# EAGLE schematic ATmega328P_CustomBd_LCD_RTCDS1307_DHT11 (EAGLE 8.2.0)
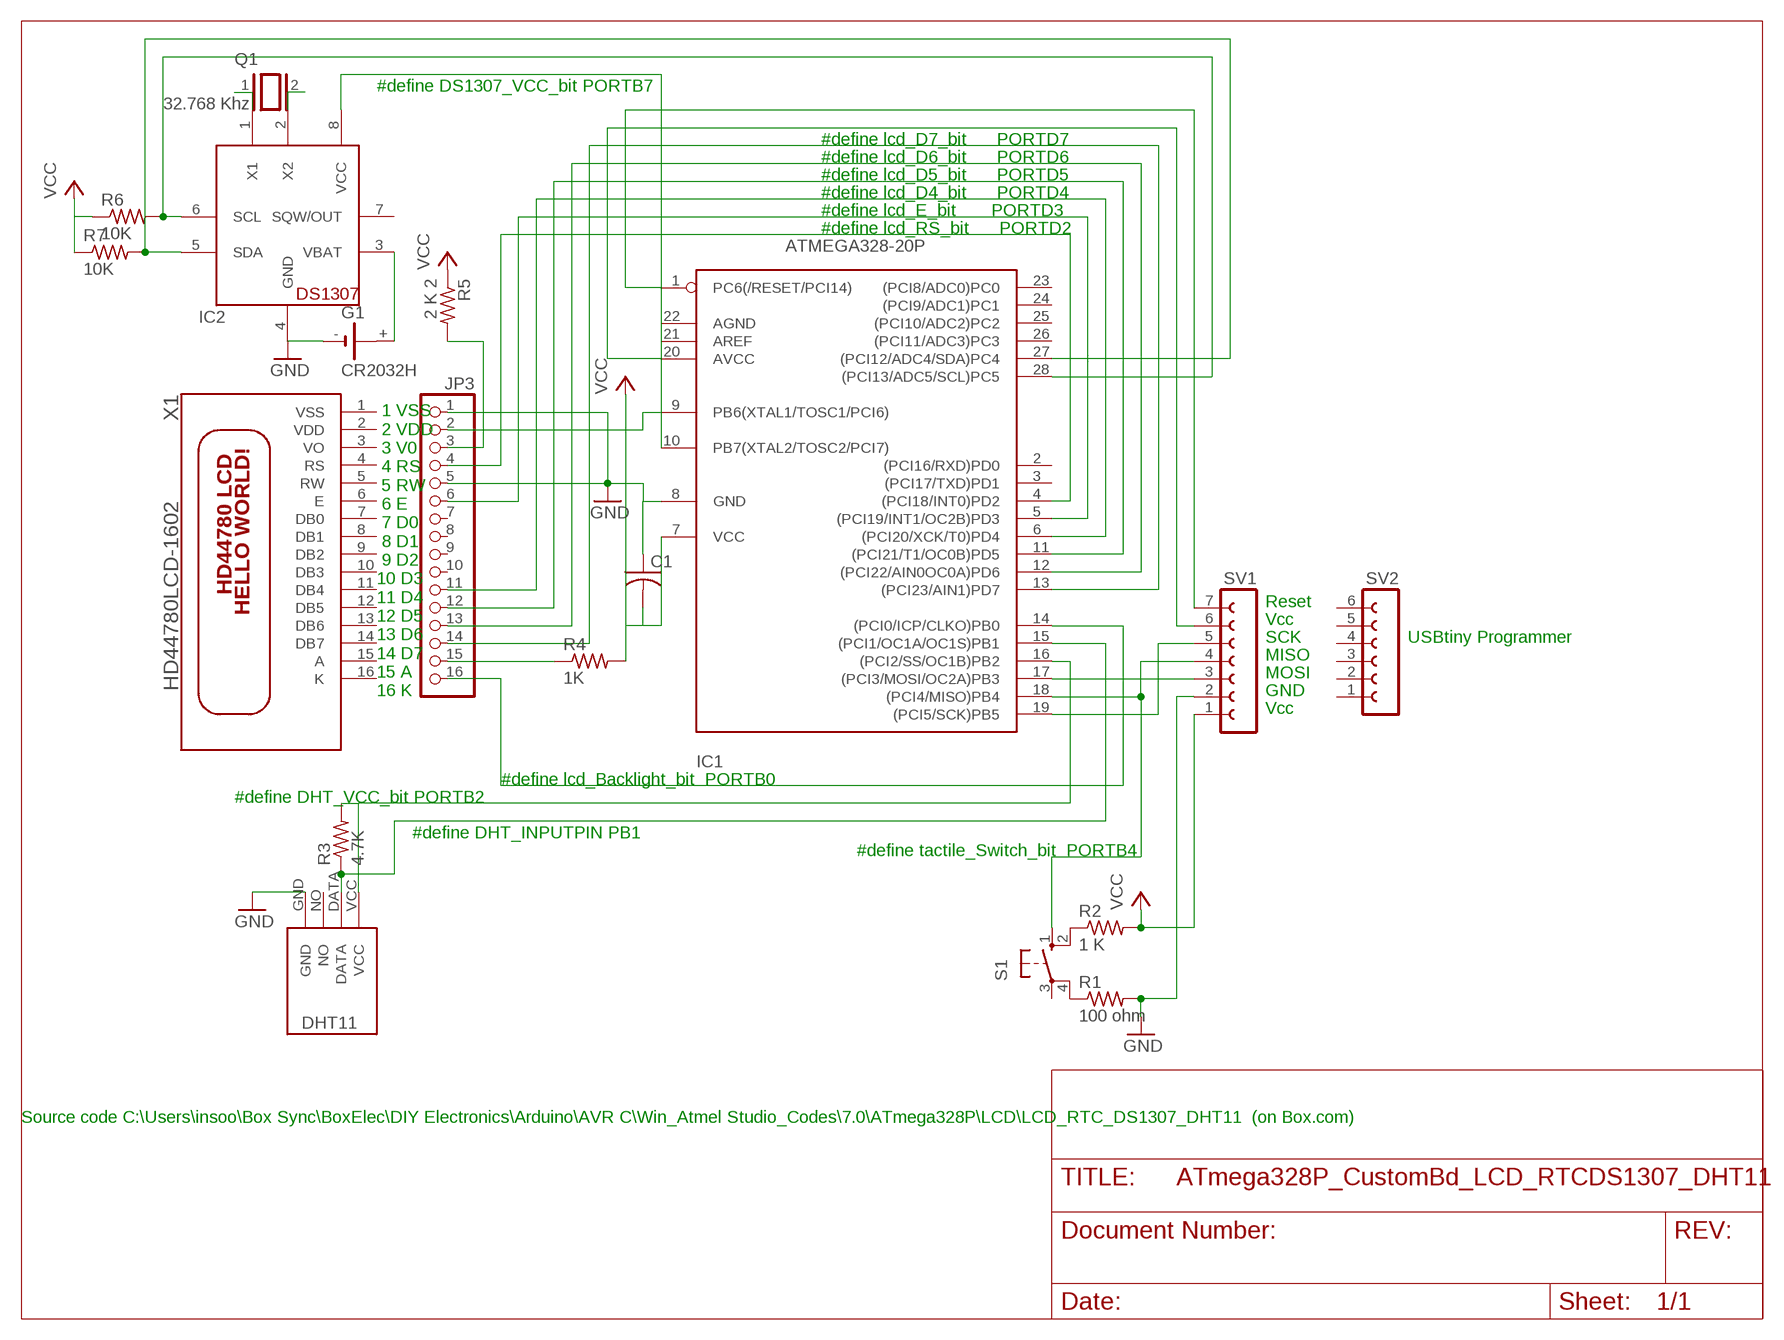
[diagram p0: schematic, sheet 1]

## Parts
C1  C-US025-024X044  [C025-024X044]
G1  CR2032H  [CR2032H]
IC1  ATMEGA328-20P  [DIL28-3]
IC2  DS1307  [DIL08]
JP3  PINHD-1X16  [1X16]
Q1  32.768 Khz  XTAL/S  [QS]
R1  100 ohm  R-US_0204/5  [0204/5]
R2  1 K  R-US_0204/5  [0204/5]
R3  4.7K  R-US_0204/5  [0204/5]
R4  1K  R-US_0204/5  [0204/5]
R5  2 K 2  R-US_0204/5  [0204/5]
R6  10K  R-US_0204/5  [0204/5]
R7  10K  R-US_0204/5  [0204/5]
S1  40-XX  [B3F-40XX]
SV1  FE07-1  [FE07]
SV2  FE06-1  [FE06]
U$1  DHT11  [DHT11]
X1  HD44780LCD-1602  [LCD1602]

## Nets
GND: C1.1 G1.- IC1.8(GND) IC2.4(GND) JP3.1 JP3.5 R1.2 SV1.2 U$1.GND
N$1: IC1.1(PC6(/RESET/PCI14)) SV1.7
N$2: IC1.20(AVCC) SV1.6
N$3: IC1.14((PCI0/ICP/CLKO)PB0) JP3.16
N$4: IC1.18((PCI4/MISO)PB4) S1.1(S) SV1.4
N$5: IC1.17((PCI3/MOSI/OC2A)PB3) SV1.3
N$6: R1.1 S1.4(P1)
N$7: R2.1 S1.2(S1)
N$8: IC1.19((PCI5/SCK)PB5) SV1.5
N$9: IC1.4((PCI18/INT0)PD2) JP3.4
N$10: C1.2 IC1.7(VCC) R4.2 ; supply symbol labelled VCC
N$11: IC1.11((PCI21/T1/OC0B)PD5) JP3.12
N$12: IC1.5((PCI19/INT1/OC2B)PD3) JP3.6
N$13: IC1.6((PCI20/XCK/T0)PD4) JP3.11
N$14: IC1.12((PCI22/AIN0OC0A)PD6) JP3.13
N$15: IC1.13((PCI23/AIN1)PD7) JP3.14
N$16: IC1.9(PB6(XTAL1/TOSC1/PCI6)) JP3.2
N$17: IC1.10(PB7(XTAL2/TOSC2/PCI7)) IC2.8(VCC)
N$18: IC1.15((PCI1/OC1A/OC1S)PB1) R3.1 U$1.DATA
N$19: JP3.3 R5.2
N$20: IC1.16((PCI2/SS/OC1B)PB2) R3.2 U$1.VCC
N$21: IC1.28((PCI13/ADC5/SCL)PC5) IC2.6(SCL) R6.2
N$22: IC1.27((PCI12/ADC4/SDA)PC4) IC2.5(SDA) R7.2
N$23: IC2.1(X1) Q1.1
N$24: IC2.2(X2) Q1.2
N$25: G1.+ IC2.3(VBAT)
NC: JP3.15 R4.1
VCC: R2.2 R5.1 R6.1 R7.1 SV1.1
Unconnected: G1.+@1(+) IC1.2((PCI16/RXD)PD0) IC1.3((PCI17/TXD)PD1) IC1.21(AREF) IC1.22(AGND) IC1.23((PCI8/ADC0)PC0) IC1.24((PCI9/ADC1)PC1) IC1.25((PCI10/ADC2)PC2) IC1.26((PCI11/ADC3)PC3) IC2.7(SQW/OUT) JP3.7 JP3.8 JP3.9 JP3.10 S1.3(P) SV2.1 SV2.2 SV2.3 SV2.4 SV2.5 SV2.6 U$1.NO X1.1(VSS) X1.2(VDD) X1.3(VO) X1.4(RS) X1.5(RW) X1.6(E) X1.7(DB0) X1.8(DB1) X1.9(DB2) X1.10(DB3) X1.11(DB4) X1.12(DB5) X1.13(DB6) X1.14(DB7) X1.15(A) X1.16(K)

## Notes on the sheet
- #define DS1307_VCC_bit PORTB7
- #define lcd_D7_bit      PORTD7
- #define lcd_D6_bit      PORTD6
- #define lcd_D5_bit      PORTD5
- #define lcd_D4_bit      PORTD4
- #define lcd_E_bit       PORTD3
- #define lcd_RS_bit      PORTD2
- Reset
- Vcc
- SCK | USBtiny Programmer
- MISO
- MOSI
- 1 VSS
   2 VDD
   3 V0
   4 RS
   5 RW
   6 E
   7 D0
   8 D1
   9 D2
  10 D3
  11 D4
  12 D5
  13 D6
  14 D7
  15 A
  16 K
- GND
- Vcc
- #define lcd_Backlight_bit  PORTB0
- #define DHT_VCC_bit PORTB2
- #define DHT_INPUTPIN PB1
- #define tactile_Switch_bit  PORTB4
- Source code C:\Users\insoo\Box Sync\BoxElec\DIY Electronics\Arduino\AVR C\Win_Atmel Studio_Codes\7.0\ATmega328P\LCD\LCD_RTC_DS1307_DHT11  (on Box.com)

## Library data of the parts
C1 = adafruit:C-US: CAPACITOR, American symbol
G1 = battery:CR2032H: LI BATTERY Varta
IC1 = atmega328:ATMEGA328*P: MICROCONTROLLER 32 kBytes FLASH 2 kBytes SRAM 1 kBytes EEPROM USART 8-channel 10 bit ADC
IC2 = adafruit:DS1307: DS1307 Real time clock (RTC) with battery backup ability. Talk to it via i2c
JP3 = pinhead:PINHD-1X16: PIN HEADER
Q1 = special:XTAL/S: CRYSTAL
R1-R7 = adafruit:R-US_: RESISTOR, American symbol
S1 = switch-omron:40-XX: OMRON SWITCH; MF: OMRON COMPONENTS USA; MPN: B3F-4000; OC_FARNELL: 176434; OC_NEWARK: 36K3105
SV1 = con-lsta:FE07-1: FEMALE HEADER; OC_FARNELL: unknown; OC_NEWARK: unknown
SV2 = con-lsta:FE06-1: FEMALE HEADER; OC_FARNELL: unknown; OC_NEWARK: unknown
U$1 = DHT11:DHT11: DHT11 Czujnik temperatury i wilgotności
X1 = adafruit:HD44780LCD: HD44780 LCD Standard character type LCDs, available in sizes from 8x1 to 40x4!